# Altium schematic sheet Multiplexed_ADC.SchDoc
size A4; CompanyName: Technische Hochschule Nürnberg Georg Simon Ohm; Organization: UltraZohm; Address1: Kesslerplatz 12; Address2: 90489 Nürnberg; Address3: GERMANY; DocumentNumber: 9; SheetNumber: 9; SheetTotal: 12; Website: www.ultrazohm.com
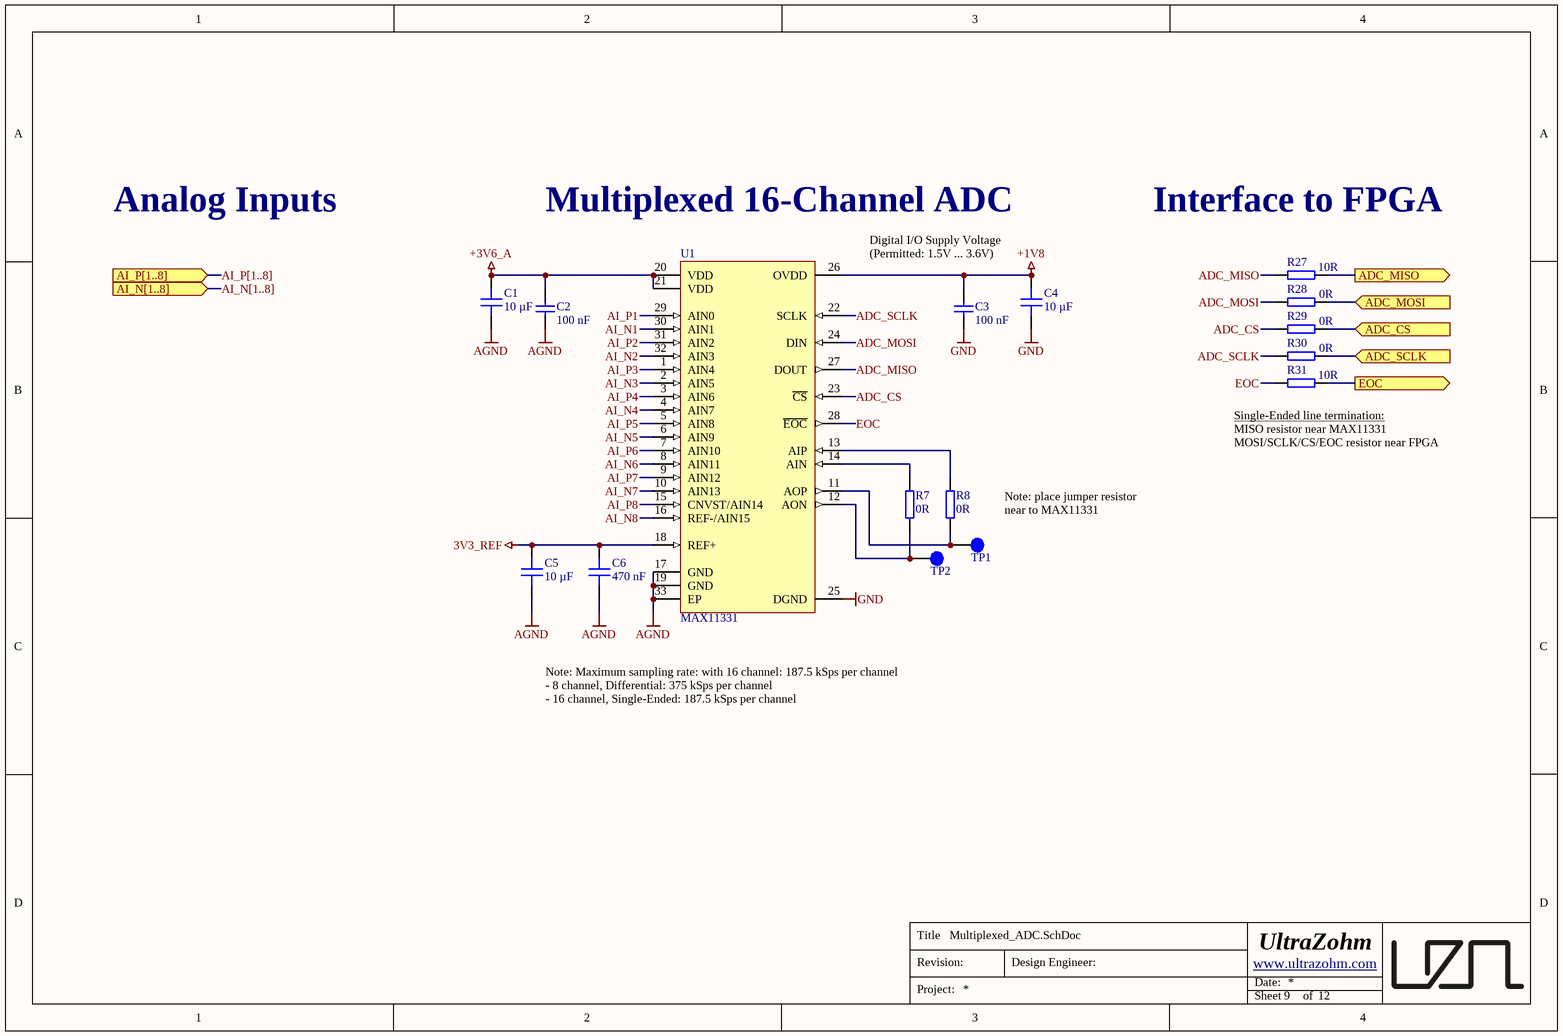
[diagram p0: Multiplexed_ADC.SchDoc]

## Parts
C1  10 µF  [C_0603_TE]
C2  100 nF  [C_0603_TE]
C3  100 nF  [C_0603_TE]
C4  10 µF  [C_0603_TE]
C5  10 µF  [C_0603_TE]
C6  470 nF  [C_0603]
R7  0R  [R_0603_TE]
R8  0R  [R_0603_TE]
R27  10R  [R_0402_TE]
R28  0R  [R_0402_TE]
R29  0R  [R_0402_TE]
R30  0R  [R_0402_TE]
R31  10R  [R_0402_TE]
TP1  Testpoint 1mm  [TP_1mm]  (value not drawn)  (no BOM)
TP2  Testpoint 1mm  [TP_1mm]  (value not drawn)  (no BOM)
U1  MAX11331  [QFN50P500X500X80-33N-310]

## Ports
ADC_CS (in), ADC_MISO (out), ADC_MOSI (in), ADC_SCLK (in), AI_N[1..8] (in), AI_P[1..8] (in), EOC (out)

## Nets
3V3_REF: C5.2 C6.2 U1.18(REF+)
+1V8: C3.2 C4.2 U1.26(OVDD)
+3V6_A: C1.2 C2.2 U1.20(VDD) U1.21(VDD)
AGND: C1.1 C2.1 C5.1 C6.1 U1.17(GND) U1.19(GND) U1.33(EP)
GND: C3.1 C4.1 U1.25(DGND)
ADC_CS: R29.1 U1.23(~{CS})
ADC_CS: R29.2 ; port ADC_CS  [a separate net that carries the same name]
ADC_MISO: R27.1 U1.27(DOUT)
ADC_MISO: R27.2 ; port ADC_MISO  [a separate net that carries the same name]
ADC_MOSI: R28.1 U1.24(DIN)
ADC_MOSI: R28.2 ; port ADC_MOSI  [a separate net that carries the same name]
ADC_SCLK: R30.1 U1.22(SCLK)
ADC_SCLK: R30.2 ; port ADC_SCLK  [a separate net that carries the same name]
AI_N1: U1.30(AIN1)
AI_N2: U1.32(AIN3)
AI_N3: U1.2(AIN5)
AI_N4: U1.4(AIN7)
AI_N5: U1.6(AIN9)
AI_N6: U1.8(AIN11)
AI_N7: U1.10(AIN13)
AI_N8: U1.16(REF-/AIN15)
AI_P1: U1.29(AIN0)
AI_P2: U1.31(AIN2)
AI_P3: U1.1(AIN4)
AI_P4: U1.3(AIN6)
AI_P5: U1.5(AIN8)
AI_P6: U1.7(AIN10)
AI_P7: U1.9(AIN12)
AI_P8: U1.15(CNVST/AIN14)
EOC: R31.1 U1.28(~{EOC})
EOC: R31.2 ; port EOC  [a separate net that carries the same name]
NetR7_1: R7.1 TP2.1 U1.12(AON)
NetR7_2: R7.2 U1.14(AIN)
NetR8_1: R8.1 TP1.1 U1.11(AOP)
NetR8_2: R8.2 U1.13(AIP)

## Buses and harness runs
bus AI_N[1..8] = port AI_N[1..8]
bus AI_P[1..8] = port AI_P[1..8]

## Notes on the sheet
- Analog Inputs
- Multiplexed 16-Channel ADC
- Digital I/O Supply Voltage
- Interface to FPGA
- (Permitted: 1.5V ... 3.6V)
- (near R31) Single-Ended line termination:
- (near R31) MISO resistor near MAX11331
- MOSI/SCLK/CS/EOC resistor near FPGA
- Note: place jumper resistor
- near to MAX11331
- Note: Maximum sampling rate: with 16 channel: 187.5 kSps per channel
- - 16 channel, Single-Ended: 187.5 kSps per channel
- - 8 channel, Differential: 375 kSps per channel
- Title
- Revision:
- Design Engineer:
- Date:
- Project:
- Sheet
- of

## Library data of the parts
C1 C4 C5 = CL10A106MO8NQNC: Capacitor 0603, 16 VDC, 10 µF, X5R; Manufacturer: Samsung Electro-Mechanics; Tolerance: 20 %; Voltage Rating: 16 VDC; Created from: AGeiger; Manufacturer Part Number: CL10A106MO8NQNC; PartID: 101; Created On: 22.08.2022 13:56:44; ComponentLink1Description: Datasheet; ComponentLink1URL: https://datasheet.lcsc.com/lcsc/1810261909_Samsung-Electro-Mechanics-CL10A106MO8NQNC_C92487.pdf; Component Type: Capacitor 0603; Device Package: 0603; Last Updated: 19.11.2024 12:34:06; Mounting Type: SMD; Operating Temperature: -55 - 85°C; Supplier 1: LCSC; Supplier Part Number 1: C92487; Type: Capacitor; Value: 10 µF; Live Cycle Status: 1; LCSC Part Number: C92487; Series: X5R
C2 C3 = UZgen_C_0603_100nF_50V_X7R: Generic capacitor; Manufacturer: UZgen; Tolerance: 10 %; Created from: AGeiger; Voltage: 50V; Manufacturer Part Number: UZgen_C_0603_100nF_50V_X7R; PartID: 1; Created On: 02.07.2024 14:42:23; Device Package: 0603; Last Updated: 08.08.2024 15:01:15; Mounting Type: SMD; Value: 100 nF; Technology: X7R
C6 = CL10A474KB8NNNC: Capacitor 0603, 50 VDC, 470 nF, X5R; Manufacturer: Samsung Electro-Mechanics; Tolerance: 10 %; Voltage Rating: 50 VDC; Created from: AGeiger; Manufacturer Part Number: CL10A474KB8NNNC; PartID: 103; Created On: 22.08.2022 14:44:45; ComponentLink1Description: Datasheet; ComponentLink1URL: https://datasheet.lcsc.com/lcsc/1810191213_Samsung-Electro-Mechanics-CL10A474KB8NNNC_C170149.pdf; Component Type: Capacitor 0603; Device Package: 0603; Last Updated: 22.08.2022 14:44:45; Mounting Type: SMD; Operating Temperature: -55 - 85°C; Supplier 1: LCSC; Supplier Part Number 1: C170149; Supplier 2: Mouser; Supplier Part Number 2: 187-CL10A474KB8NNNC; Type: Capacitor; Value: 470 nF; Live Cycle Status: 1; LCSC Part Number: C170149
R7 R8 = UZgen_R_0603_0R: Generic resistor; Manufacturer: UZgen; Tolerance: 1 %; Created from: UZgenTool; Manufacturer Part Number: UZgen_R_0603_0R; PartID: 581; Created On: 08.07.2024 14:34:30; Value: 0R; Device Package: 0603; Mounting Type: SMD; Last Updated: 08.07.2024 14:34:30
R27 R31 = UZgen_R_0402_10R: Generic resistor; Manufacturer: UZgen; Tolerance: 1 %; Created from: UZgenTool; Manufacturer Part Number: UZgen_R_0402_10R; PartID: 29; Created On: 02.07.2024 17:29:44; Device Package: 0402; Last Updated: 02.07.2024 17:29:44; Mounting Type: SMD; Value: 10R
R28-R30 = UZgen_R_0402_0R: Generic resistor; Manufacturer: UZgen; Tolerance: 1 %; Created from: UZgenTool; Manufacturer Part Number: UZgen_R_0402_0R; PartID: 580; Created On: 08.07.2024 14:34:30; Device Package: 0402; Last Updated: 08.07.2024 14:34:30; Mounting Type: SMD; Value: 0R
TP1 TP2 = Testpoint_1mm: Manufacturer: UltraZohm; Created from: AGeiger; Created: 2018_06_25_AGeiger; Value: Testpoint 1mm; Manufacturer Part Number: Testpoint_1mm; PartID: 9; Created On: 20.09.2022 13:14:57; Component Type: Testpoint; Last Updated: 14.08.2025 11:47:07; Supplier 1: NULL; Supplier Part Number 1: NULL; Type: Testpoint; Live Cycle Status: 1
U1 = MAX11331ATJ+: 3Msps, 12-/10-Bit, 8-/16-Channel ADCs with Post-Mux External Signal Conditioning Access; Manufacturer: Maxim Integrated; Channels: 16; Resolution: 12 bit; Created from: AGeiger; Manufacturer Part Number: MAX11331ATJ+; PartID: 4; Created On: 25.08.2022 14:24:25; ComponentLink1Description: Datasheet; ComponentLink1URL: https://datasheets.maximintegrated.com/en/ds/MAX11329-MAX11332.pdf; Component Type: ADC; Device Package: TQFN-32 EP; Last Updated: 25.08.2022 14:27:33; Mounting Type: SMD; Operating Temperature: -40 - 125 °C; Supplier 1: Mouser; Supplier Part Number 1: 700-MAX11331ATJ+; Type: ADC; Value: MAX11331; Live Cycle Status: 1; LCSC Part Number: C1543252